# EAGLE design digital_warrior_v02 (EAGLE 6.3)
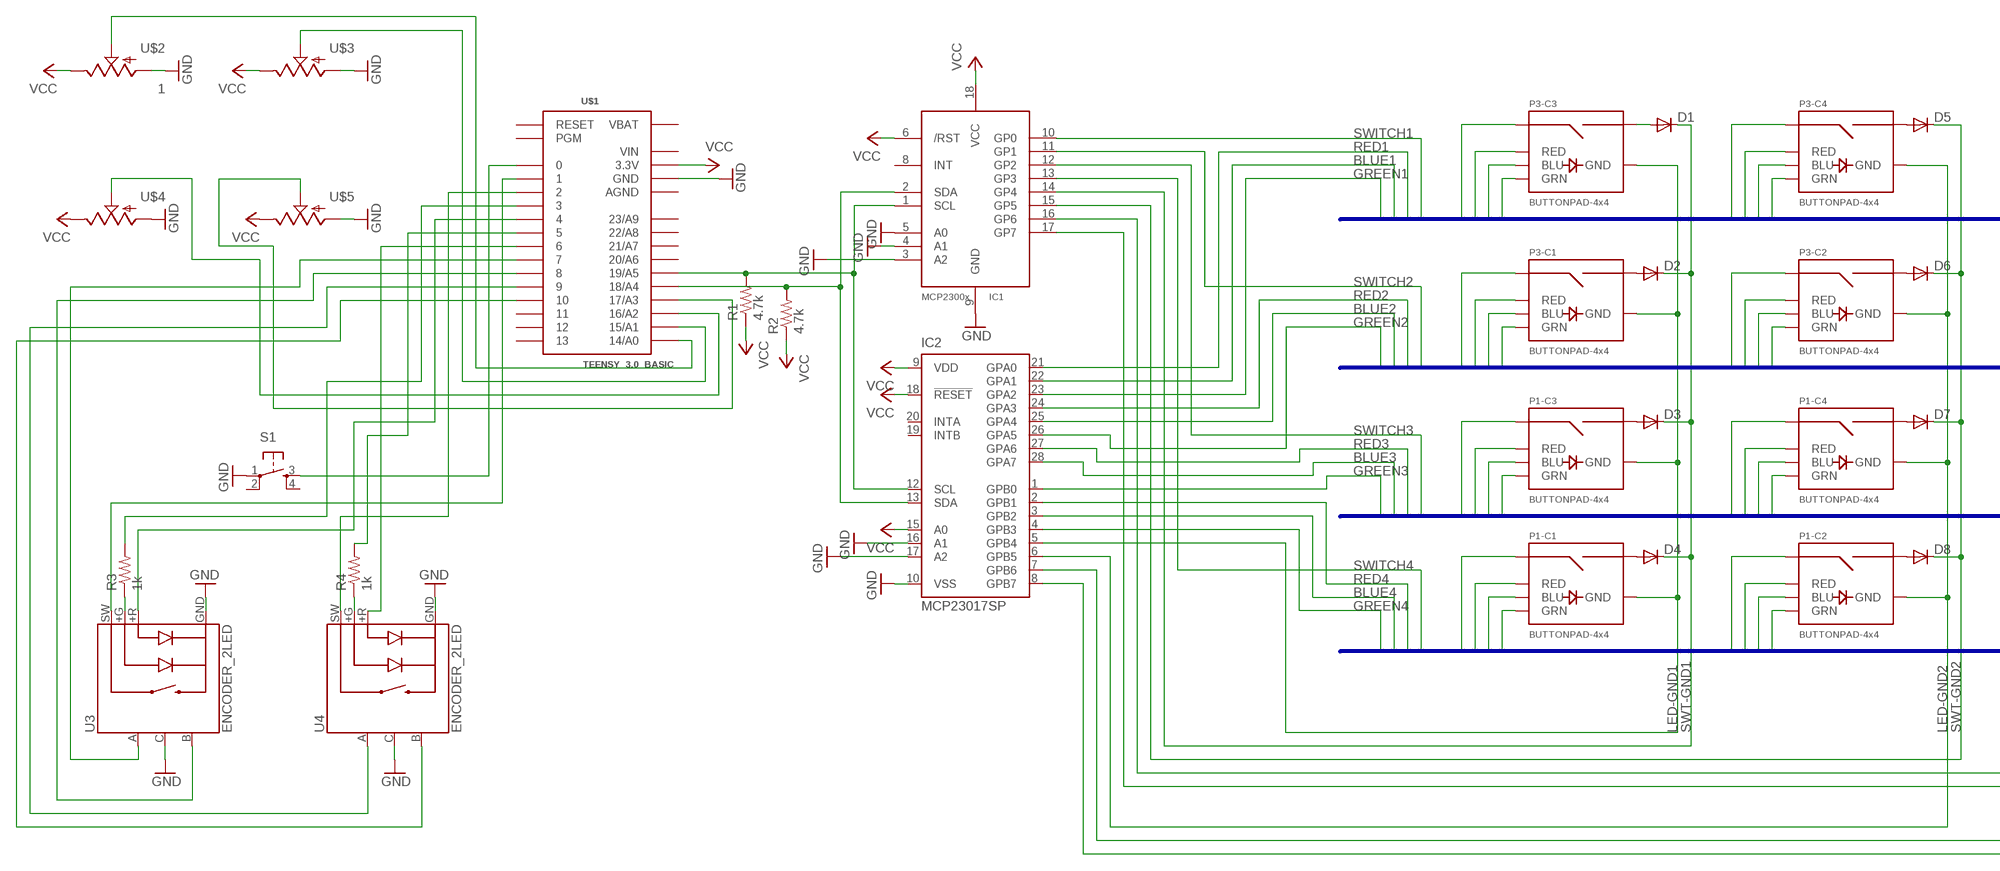
[diagram p0: schematic, sheet 1, part 1 of 2]
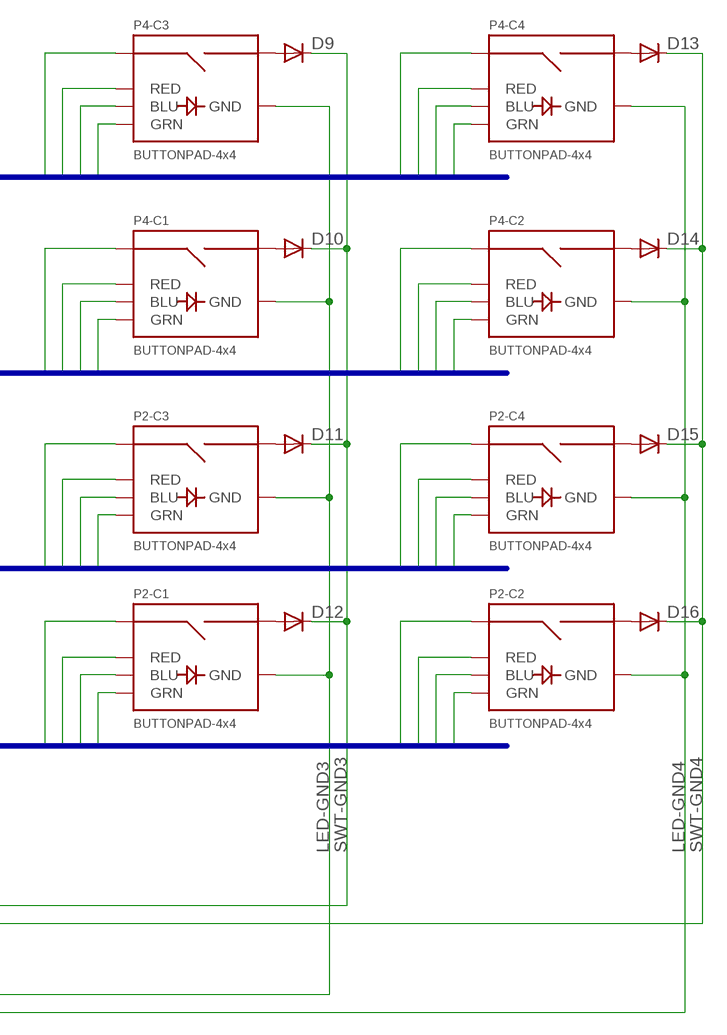
[diagram p1: schematic, sheet 1, part 2 of 2]

## Parts
D1  DIODE-1N4148  [DOIDE-1N4148]
D2  DIODE-1N4148  [DOIDE-1N4148]
D3  DIODE-1N4148  [DOIDE-1N4148]
D4  DIODE-1N4148  [DOIDE-1N4148]
D5  DIODE-1N4148  [DOIDE-1N4148]
D6  DIODE-1N4148  [DOIDE-1N4148]
D7  DIODE-1N4148  [DOIDE-1N4148]
D8  DIODE-1N4148  [DOIDE-1N4148]
D9  DIODE-1N4148  [DOIDE-1N4148]
D10  DIODE-1N4148  [DOIDE-1N4148]
D11  DIODE-1N4148  [DOIDE-1N4148]
D12  DIODE-1N4148  [DOIDE-1N4148]
D13  DIODE-1N4148  [DOIDE-1N4148]
D14  DIODE-1N4148  [DOIDE-1N4148]
D15  DIODE-1N4148  [DOIDE-1N4148]
D16  DIODE-1N4148  [DOIDE-1N4148]
IC1  MCP2300X/P  [DIL18]
IC2  MCP23017SP  [DIL28-3]
P1  BUTTONPAD-4x4  BUTTONPAD-2X2  [BUTTONPAD-2X2]
P2  BUTTONPAD-4x4  BUTTONPAD-2X2  [BUTTONPAD-2X2]
P3  BUTTONPAD-4x4  BUTTONPAD-2X2  [BUTTONPAD-2X2]
P4  BUTTONPAD-4x4  BUTTONPAD-2X2  [BUTTONPAD-2X2]
R1  4.7k  RESISTORPTH-1/4W  [AXIAL-0.4]
R2  4.7k  RESISTORPTH-1/4W  [AXIAL-0.4]
R3  1k  RESISTORPTH-1/4W  [AXIAL-0.4]
R4  1k  RESISTORPTH-1/4W  [AXIAL-0.4]
S1  TAC_SWITCHPTH  [TACTILE-PTH]
U3  ENCODER_2LED  [ENCODER_LED_2]
U4  ENCODER_2LED  [ENCODER_LED_2]
U$1  TEENSY_3.0_BASIC  [TEENSY_3.0_BASIC]
U$2  1  POT  [ALPS_POT]
U$3  POT  [ALPS_POT]
U$4  POT  [ALPS_POT]
U$5  POT  [ALPS_POT]

## Nets
BLUE1 [LEDPower]: IC2.22(GPA1) P3.BLU3(-C3:BLU) P3.BLU4(-C4:BLU) P4.BLU3(-C3:BLU) P4.BLU4(-C4:BLU)
BLUE2 [LEDPower]: IC2.25(GPA4) P3.BLU1(-C1:BLU) P3.BLU2(-C2:BLU) P4.BLU1(-C1:BLU) P4.BLU2(-C2:BLU)
BLUE3 [LEDPower]: IC2.28(GPA7) P1.BLU3(-C3:BLU) P1.BLU4(-C4:BLU) P2.BLU3(-C3:BLU) P2.BLU4(-C4:BLU)
BLUE4 [LEDPower]: IC2.3(GPB2) P1.BLU1(-C1:BLU) P1.BLU2(-C2:BLU) P2.BLU1(-C1:BLU) P2.BLU2(-C2:BLU)
GND: IC1.3(A2) IC1.4(A1) IC1.5(A0) IC1.9(GND) IC2.10(VSS) IC2.16(A1) IC2.17(A2) S1.1 U3.C U3.GND(-) U4.C U4.GND(-) U$1.GND U$1.GND1(GND) U$2.P$3(A) U$3.P$3(A) U$4.P$3(A) U$5.P$3(A)
GREEN1 [LEDPower]: IC2.23(GPA2) P3.GRN3(-C3:GRN) P3.GRN4(-C4:GRN) P4.GRN3(-C3:GRN) P4.GRN4(-C4:GRN)
GREEN2 [LEDPower]: IC2.26(GPA5) P3.GRN1(-C1:GRN) P3.GRN2(-C2:GRN) P4.GRN1(-C1:GRN) P4.GRN2(-C2:GRN)
GREEN3 [LEDPower]: IC2.1(GPB0) P1.GRN3(-C3:GRN) P1.GRN4(-C4:GRN) P2.GRN3(-C3:GRN) P2.GRN4(-C4:GRN)
GREEN4 [LEDPower]: IC2.4(GPB3) P1.GRN1(-C1:GRN) P1.GRN2(-C2:GRN) P2.GRN1(-C1:GRN) P2.GRN2(-C2:GRN)
LED-GND1 [LEDPower]: IC2.5(GPB4) P1.GND1(-C1:GND) P1.GND3(-C3:GND) P3.GND1(-C1:GND) P3.GND3(-C3:GND)
LED-GND2 [LEDPower]: IC2.6(GPB5) P1.GND2(-C2:GND) P1.GND4(-C4:GND) P3.GND2(-C2:GND) P3.GND4(-C4:GND)
LED-GND3 [LEDPower]: IC2.7(GPB6) P2.GND1(-C1:GND) P2.GND3(-C3:GND) P4.GND1(-C1:GND) P4.GND3(-C3:GND)
LED-GND4 [LEDPower]: IC2.8(GPB7) P2.GND2(-C2:GND) P2.GND4(-C4:GND) P4.GND2(-C2:GND) P4.GND4(-C4:GND)
N$1: D1.P$1(A) P3.SIG6(-C3:SIG2)
N$2: D2.P$1(A) P3.SIG2(-C1:SIG2)
N$3: D3.P$1(A) P1.SIG6(-C3:SIG2)
N$4: D4.P$1(A) P1.SIG2(-C1:SIG2)
N$5: D5.P$1(A) P3.SIG8(-C4:SIG2)
N$6: D6.P$1(A) P3.SIG4(-C2:SIG2)
N$7: D7.P$1(A) P1.SIG8(-C4:SIG2)
N$8: D8.P$1(A) P1.SIG4(-C2:SIG2)
N$9: D9.P$1(A) P4.SIG6(-C3:SIG2)
N$10: D10.P$1(A) P4.SIG2(-C1:SIG2)
N$11: D11.P$1(A) P2.SIG6(-C3:SIG2)
N$12: D12.P$1(A) P2.SIG2(-C1:SIG2)
N$13: D13.P$1(A) P4.SIG8(-C4:SIG2)
N$14: D14.P$1(A) P4.SIG4(-C2:SIG2)
N$15: D15.P$1(A) P2.SIG8(-C4:SIG2)
N$16: D16.P$1(A) P2.SIG4(-C2:SIG2)
N$17: IC1.1(SCL) IC2.12(SCL) R1.P$2 U$1.19/A5
N$18: IC1.2(SDA) IC2.13(SDA) R2.P$2 U$1.18/A4
N$19: U$1.14/A0 U$2.P$2(S)
N$20: U$1.15/A1 U$3.P$2(S)
N$21: U$1.16/A2 U$4.P$2(S)
N$22: U$1.17/A3 U$5.P$2(S)
N$23: S1.3 U$1.0
N$24: U3.SW U$1.1
N$25: U4.SW U$1.2
N$26: R3.P$2 U$1.3
N$27: U3.+R U$1.4
N$28: R3.P$1 U3.+G
N$29: R4.P$1 U4.+G
N$30: R4.P$2 U$1.5
N$31: U4.+R U$1.6
N$32: U3.A U$1.7
N$33: U3.B U$1.8
N$34: U4.A U$1.9
N$35: U4.B U$1.10
RED1 [LEDPower]: IC2.21(GPA0) P3.RED3(-C3:RED) P3.RED4(-C4:RED) P4.RED3(-C3:RED) P4.RED4(-C4:RED)
RED2 [LEDPower]: IC2.24(GPA3) P3.RED1(-C1:RED) P3.RED2(-C2:RED) P4.RED1(-C1:RED) P4.RED2(-C2:RED)
RED3 [LEDPower]: IC2.27(GPA6) P1.RED3(-C3:RED) P1.RED4(-C4:RED) P2.RED3(-C3:RED) P2.RED4(-C4:RED)
RED4 [LEDPower]: IC2.2(GPB1) P1.RED1(-C1:RED) P1.RED2(-C2:RED) P2.RED1(-C1:RED) P2.RED2(-C2:RED)
SWITCH1 [ButtonSignal]: IC1.10(GP0) P3.SIG5(-C3:SIG1) P3.SIG7(-C4:SIG1) P4.SIG5(-C3:SIG1) P4.SIG7(-C4:SIG1)
SWITCH2 [ButtonSignal]: IC1.11(GP1) P3.SIG1(-C1:SIG1) P3.SIG3(-C2:SIG1) P4.SIG1(-C1:SIG1) P4.SIG3(-C2:SIG1)
SWITCH3 [ButtonSignal]: IC1.12(GP2) P1.SIG5(-C3:SIG1) P1.SIG7(-C4:SIG1) P2.SIG5(-C3:SIG1) P2.SIG7(-C4:SIG1)
SWITCH4 [ButtonSignal]: IC1.13(GP3) P1.SIG1(-C1:SIG1) P1.SIG3(-C2:SIG1) P2.SIG1(-C1:SIG1) P2.SIG3(-C2:SIG1)
SWT-GND1 [ButtonSignal]: D1.P$2(C) D2.P$2(C) D3.P$2(C) D4.P$2(C) IC1.14(GP4)
SWT-GND2 [ButtonSignal]: D5.P$2(C) D6.P$2(C) D7.P$2(C) D8.P$2(C) IC1.15(GP5)
SWT-GND3 [ButtonSignal]: D9.P$2(C) D10.P$2(C) D11.P$2(C) D12.P$2(C) IC1.16(GP6)
SWT-GND4 [ButtonSignal]: D13.P$2(C) D14.P$2(C) D15.P$2(C) D16.P$2(C) IC1.17(GP7)
VCC: IC1.6(/RST) IC1.18(VCC) IC2.9(VDD) IC2.15(A0) IC2.18(!RESET) R1.P$1 R2.P$1 U$1.3.3V U$1.3.3V1(3.3V) U$2.P$1(E) U$3.P$1(E) U$4.P$1(E) U$5.P$1(E)
Unconnected: IC1.8(INT) IC2.19(INTB) IC2.20(INTA) S1.2 S1.4 U$1.11 U$1.12 U$1.13 U$1.20/A6 U$1.21/A7 U$1.22/A8 U$1.23/A9 U$1.PGM U$1.RESET

## Buses
BUS3:RED3,BLUE3,GREEN3,SWITCH3
BUS2:RED2,BLUE2,GREEN2,SWITCH2
BUS1:RED1,BLUE1,GREEN1,SWITCH1
BUS4:RED4,BLUE4,GREEN4,SWITCH4

## Power pins joined to a net without a drawn wire
AGND: U$1.AGND
VBAT: U$1.VBAT
VIN: U$1.VIN

## Library data of the parts
D1-D16 = SparkFun:DIODE-1N4148
IC1 = adafruit:MCP2300X: MCP23008 Inexpensive i2c i/o expander - 8 general purpose i/o pins with optional pullups
IC2 = adafruit:MCP23017: http://ww1.microchip.com/downloads/en/DeviceDoc/21952a.pdf Source: http://ww1.microchip.com/downloads/en/DeviceDoc/21952a.pdf
P1-P4 = SparkFun:BUTTONPAD-2X2: 5mm Button Pad Proven layout and schematic for 2x2 button pad. Panelize this device/fp to a 4x4 pad if needed. Spark Fun Electronics SKU : COM-07835. Compatible common cathode tri-color LED SKU : COM-00105
R1 R2 = SparkFun:RESISTOR: Resistor Basic schematic elements and footprints for 0603, 1206, and PTH resistors.
R3 R4 = SparkFun-Resistors:RESISTOR: Resistor Basic schematic elements and footprints for 0603, 1206, and PTH resistors.
S1 = SparkFun-Electromechanical:TAC_SWITCH: Momentary Switch Button commonly used for reset or general input. Spark Fun Electronics SKU : COM-00097 SMT- SWCH-08247
U3 U4 = SparkFun-Electromechanical:ENCODER_2LED: Illuminated Rotary Encoder w/ 2 LEDs
U$1 = Teensy3.0:TEENSY_3.0_BASIC: Basic Teensy 3.0 with none of the 'inner' pins enabled. See '+4', 'AllAnalogPins", and 'AllPins' packages for additional pin holes, as needed.
U$2-U$5 = SparkFun-Electromechanical:POT

## Net classes
0 Default: width 0.254 mm
1 Power: width 0.305 mm
2 LEDPower: width 0.305 mm
3 ButtonSignal: width 0.254 mm

## Board
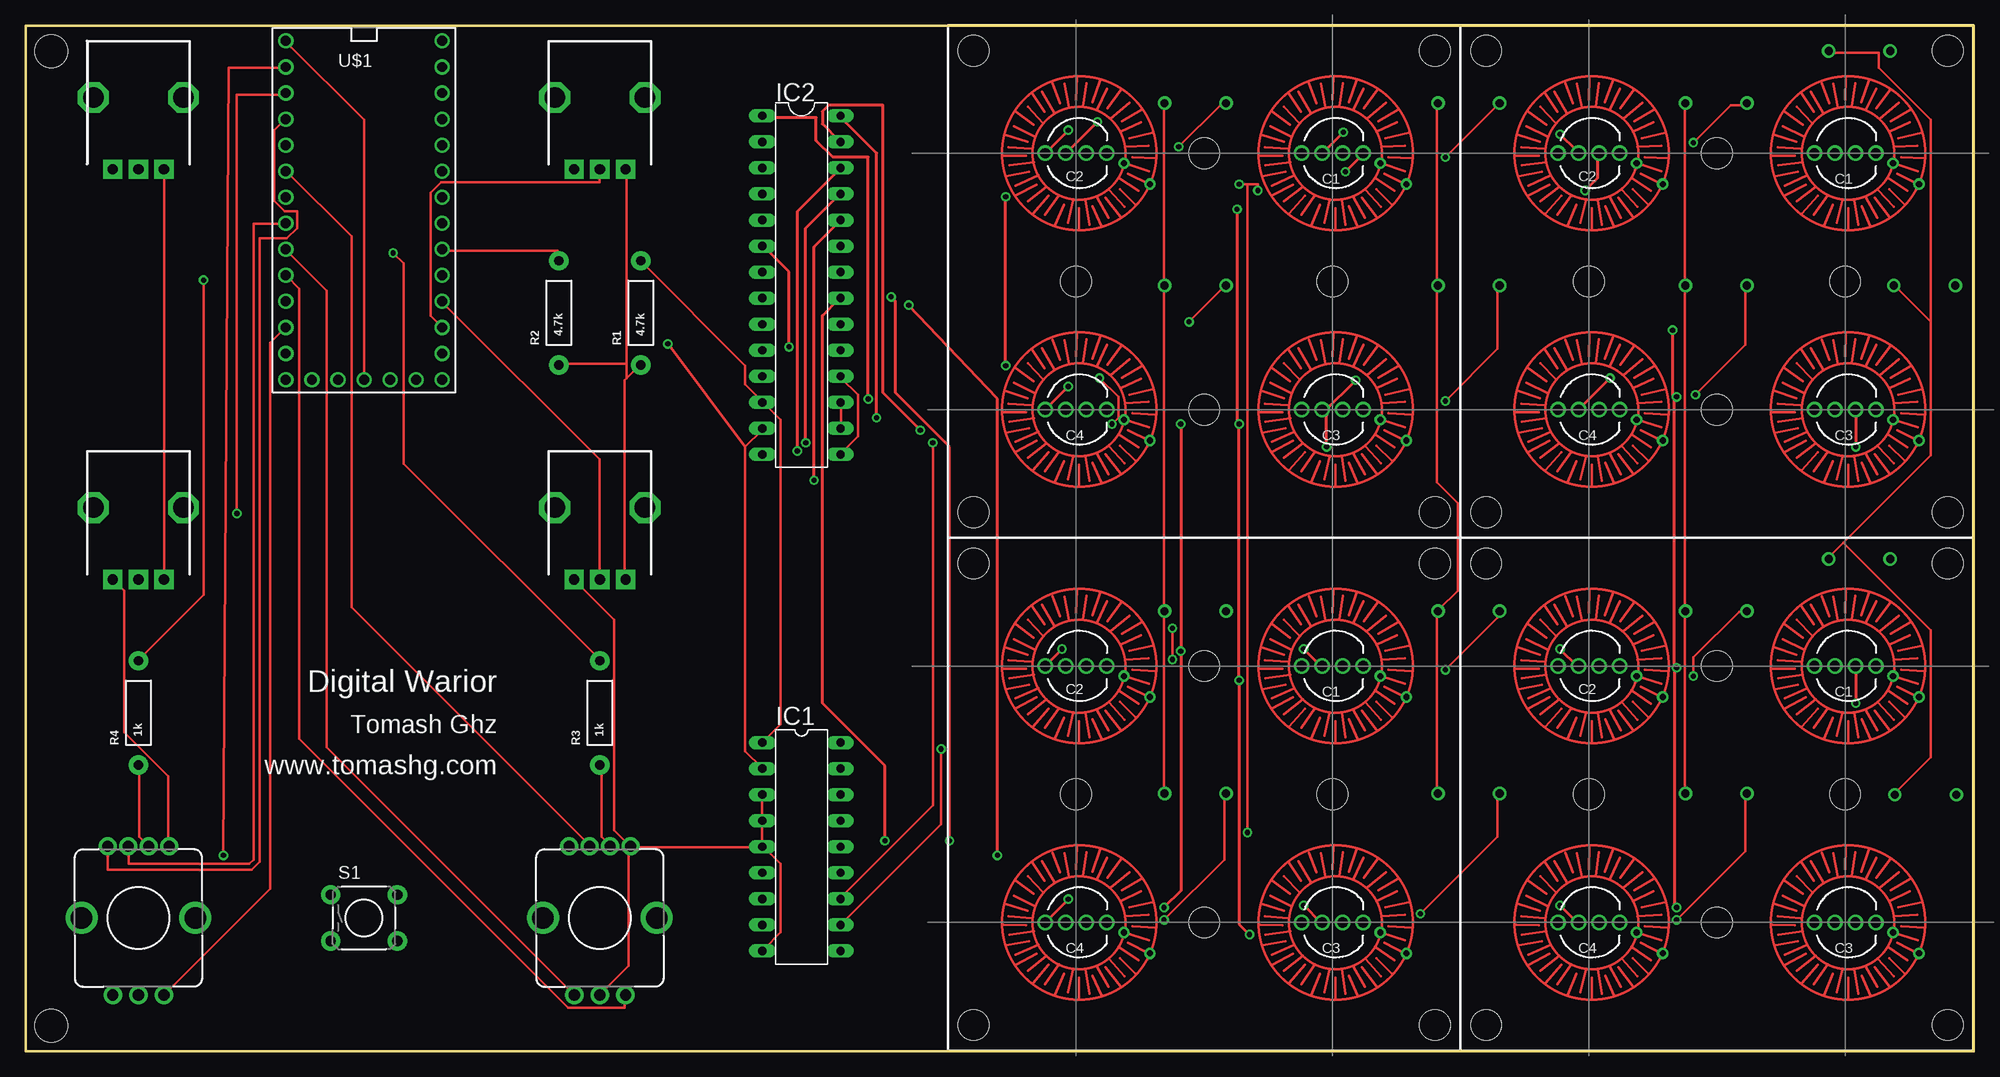
[diagram p2: board, top side]
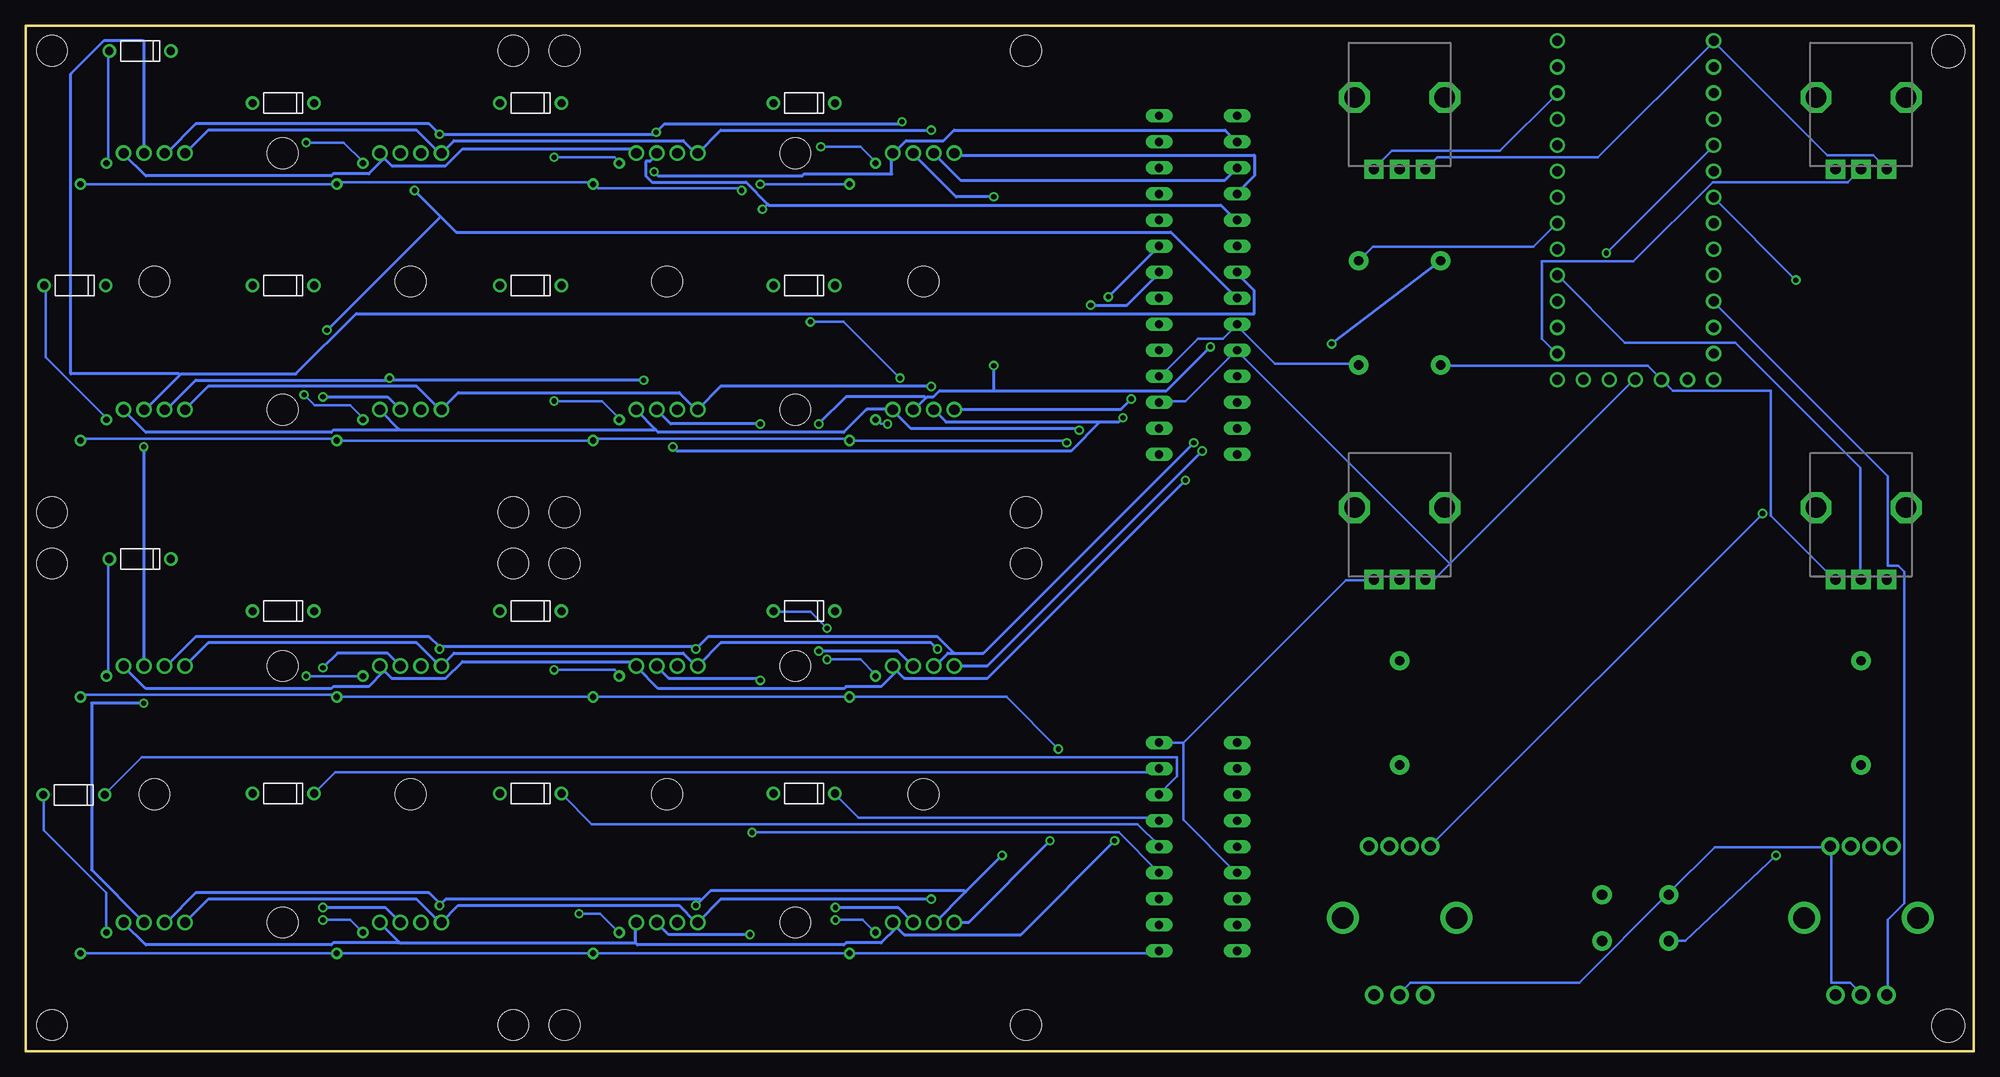
[diagram p3: board, bottom side, seen from below]

Size 190 x 100 mm. Coordinates in mm from the lower left corner, seen from the top.
Outline: 0,0 190,0 190,100 0,100 0,0
Copper layers (1*16): Top 0.035mm / dielectric 1.5mm / Bottom 0.035mm
Design rules "default": minimum track width 7mil, minimum drill 20mil, track to track 7mil, track to pad 7mil, pad to pad 7mil, via to via 7mil, smd to smd 7mil, copper to edge 20mil, drill to drill 7mil, minimum pad ring 10mil, minimum via ring 8mil, stop-mask expansion 4mil, vias tented up to drill 0mil, thermal gap 10mil
Holes 3.2 mm at 2.5,97.5 2.5,2.5

### Footprints (pad centres in the part's own frame; a part is rotated, then mirrored left to right if it is on the bottom)
DOIDE-1N4148 = drill 0.8: P$1 3,0; P$2 -3,0
DIL18 = drill 0.813 long: 1 -10.16,-3.81; 2 -7.62,-3.81; 3 -5.08,-3.81; 4 -2.54,-3.81; 5 0,-3.81; 6 2.54,-3.81; 7 5.08,-3.81; 8 7.62,-3.81; 9 10.16,-3.81; 10 10.16,3.81; 11 7.62,3.81; 12 5.08,3.81; 13 2.54,3.81; 14 0,3.81; 15 -2.54,3.81; 16 -5.08,3.81; 17 -7.62,3.81; 18 -10.16,3.81
DIL28-3 = drill 0.813 long: 1 -16.51,-3.81; 2 -13.97,-3.81; 3 -11.43,-3.81; 4 -8.89,-3.81; 5 -6.35,-3.81; 6 -3.81,-3.81; 7 -1.27,-3.81; 8 1.27,-3.81; 9 3.81,-3.81; 10 6.35,-3.81; 11 8.89,-3.81; 12 11.43,-3.81; 13 13.97,-3.81; 14 16.51,-3.81; 15 16.51,3.81; 16 13.97,3.81; 17 11.43,3.81; 18 8.89,3.81; 19 6.35,3.81; 20 3.81,3.81; 21 1.27,3.81; 22 -1.27,3.81; 23 -3.81,3.81; 24 -6.35,3.81; 25 -8.89,3.81; 26 -11.43,3.81; 27 -13.97,3.81; 28 -16.51,3.81
BUTTONPAD-2X2 = drill 1: BLU1 13.5,12.5; BLU2 38.5,12.5; BLU3 13.5,37.5; BLU4 38.5,37.5; GND1 11.5,12.5; GND2 36.5,12.5; GND3 11.5,37.5; GND4 36.5,37.5; GRN1 15.5,12.5; GRN2 40.5,12.5; GRN3 15.5,37.5; GRN4 40.5,37.5; RED1 9.5,12.5; RED2 34.5,12.5; RED3 9.5,37.5; RED4 34.5,37.5 | drill 0.6: SIG1 5.288,15.513; SIG2 7.828,13.481; SIG3 30.288,15.513; SIG4 32.828,13.481; SIG5 5.288,40.513; SIG6 7.828,38.481; SIG7 30.288,40.513; SIG8 32.828,38.481 | hole 3: 12.5,25; 25,37.5; 37.5,25; 25,12.5; 2.5,2.5; 2.5,47.5; 47.5,47.5; 47.5,2.5
AXIAL-0.4 = drill 0.9 pad 1.88: P$1 -5.08,0; P$2 5.08,0
TACTILE-PTH = drill 1.016 pad 1.88: 1 -3.251,2.261; 2 3.251,2.261; 3 -3.251,-2.261; 4 3.251,-2.261
ENCODER_LED_2 = drill 1.1 pad 1.778: +G 1,7; +R -1,7; GND 3,7; SW -3,7 | drill 1.1 pad 1.8: A -2.5,-7.5; B 2.5,-7.5; C 0,-7.5 | drill 2.1: P$1 -5.55,0; P$2 5.55,0
TEENSY_3.0_BASIC = drill 0.965: 0 -7.62,13.97; 1 -7.62,11.43; 2 -7.62,8.89; 3 -7.62,6.35; 3.3V 7.62,11.43; 3.3V1 -2.54,-16.51; 4 -7.62,3.81; 5 -7.62,1.27; 6 -7.62,-1.27; 7 -7.62,-3.81; 8 -7.62,-6.35; 9 -7.62,-8.89; 10 -7.62,-11.43; 11 -7.62,-13.97; 12 -7.62,-16.51; 13 7.62,-16.51; 14/A0 7.62,-13.97; 15/A1 7.62,-11.43; 16/A2 7.62,-8.89; 17/A3 7.62,-6.35; 18/A4 7.62,-3.81; 19/A5 7.62,-1.27; 20/A6 7.62,1.27; 21/A7 7.62,3.81; 22/A8 7.62,6.35; 23/A9 7.62,8.89; AGND 7.62,13.97; GND -7.62,16.51; GND1 0,-16.51; PGM 2.54,-16.51; RESET 5.08,-16.51; VBAT -5.08,-16.51; VIN 7.62,16.51
ALPS_POT = drill 1 pad 1.88 square: P$1 7,-2.5; P$2 7,0; P$3 7,2.5 | drill 2 octagon: P$4 0,-4.4; P$5 0,4.4

### Placement (x,y rotation side)
D1  140.74,25.13 180 bottom
D2  140.74,42.91 180 bottom
D3  140.74,74.66 180 bottom
D4  140.74,92.44 180 bottom
D5  114.07,25.13 180 bottom
D6  114.07,42.91 180 bottom
D7  114.07,74.66 180 bottom
D8  114.07,92.44 180 bottom
D9  185.29,25.01 180 bottom
D10  178.84,47.99 180 bottom
D11  185.19,74.66 180 bottom
D12  178.84,97.52 180 bottom
D13  164.87,25.13 180 bottom
D14  164.87,42.91 180 bottom
D15  164.87,74.66 180 bottom
D16  164.87,92.44 180 bottom
IC1  75.66,19.94 270 top
IC2  75.66,74.7 270 top
P1  139.94,100.06 180 top
P2  189.94,100.06 180 top
P3  139.94,50.06 180 top
P4  189.94,50.06 180 top
R1  60,72 90 top
R2  52,72 90 top
R3  56,33 90 top
R4  11,33 90 top
S1  33,13 0 top
U3  56,13 0 top
U4  11,13 0 top
U$1  33,82 0 top
U$2  11,93 270 bottom
U$3  56,93 270 bottom
U$4  56,53 270 bottom
U$5  11,53 270 bottom

### Tracks (layer width: path | path; a pad name or v marks a point on that pad's centre or on a via)
BLUE1  (via drill 0.51)
  Top 0.305: v86.13,72.75 94.77,63.6 v94.77,19.1 | v124.64,14.22 126.27,12.6 P3.BLU3 | v149.63,14.22 151.26,12.6 P4.BLU4
  Bottom 0.305: v86.13,72.75 82.58,72.75 79.53,75.79 IC2.22 | 98.33,15.54 101.27,12.6 P3.BLU4 | 98.33,15.54 v94.77,19.1 | 124.13,14.73 123.22,15.65 98.43,15.65 98.33,15.54 | 124.13,14.73 v124.64,14.22 | 124.13,14.73 124.23,14.83 149.03,14.83 v149.63,14.22 149.63,14.43 150.65,15.44 173.41,15.44 176.25,12.6 P4.BLU3
BLUE2  (via drill 0.51)
  Top 0.305: v76.08,59.33 76.08,80.26 79.33,83.52 IC2.25 | v124.64,39.22 126.27,37.59 P3.BLU1 | v149.63,39.22 151.26,37.59 P4.BLU2
  Bottom 0.305: v76.08,59.33 96.6,38.81 99.44,38.81 | 99.44,38.81 100.05,38.81 101.27,37.59 P3.BLU2 | 99.44,38.81 101.07,40.44 123.42,40.44 v124.64,39.22 124.64,39.42 149.43,39.42 v149.63,39.22 149.63,39.42 150.65,40.44 173.41,40.44 176.25,37.59 P4.BLU1
BLUE3  (via drill 0.51)
  Top 0.305: v154.51,65.63 151.46,62.59 P2.BLU4 | v82.99,61.77 82.99,87.58 79.53,91.03 IC2.28 | v126.88,58.93 126.88,61.98 126.47,62.38 P1.BLU3 126.67,62.38 v129.72,65.43
  Bottom 0.305: P2.BLU3 176.25,62.59 173.41,65.43 154.72,65.43 v154.51,65.63 154.51,65.43 v129.72,65.43 | v82.99,61.77 83.39,61.37 85.22,61.37 | 85.22,61.37 100.26,61.37 101.27,62.38 P1.BLU4 | v126.88,58.93 126.47,58.52 88.07,58.52 85.22,61.37
BLUE4  (via drill 0.51)
  Top 0.305: v128.5,89.61 126.47,87.58 P1.BLU1 | v149.63,89.41 151.26,87.78 151.26,87.58 P2.BLU2 | v104.53,90.63 101.48,87.58 P1.BLU2
  Bottom 0.305: IC2.3 72.01,85.95 73.03,84.94 98.83,84.94 101.27,87.38 P1.BLU2 | P2.BLU1 176.25,87.58 173.41,90.42 150.65,90.42 v149.63,89.41 128.71,89.41 v128.5,89.61 127.69,90.42 104.73,90.42 v104.53,90.63
GND
  Top 0.254: U$5.P$3 8.61,45.92 9.63,44.91 9.63,31.09 13.9,26.82 13.9,20.12 U4.GND | 25.48,98.55 U$1.GND 25.48,98.35 33,90.83 33,65.63 U$1.GND1 | 71.81,9.75 IC1.9 72.01,9.96 73.64,11.58 73.64,18.29 72.01,19.91 IC1.5 | IC1.5 71.81,20.12 71.81,22.35 IC1.4 71.81,22.55 71.81,24.99 IC1.3 | U3.GND 59.01,19.91 71.81,19.91 IC1.5 | U3.C 56.16,5.69 58.8,8.33 58.8,19.91 U3.GND | IC2.16 79.53,60.76 79.53,63.2 IC2.17 | U3.GND 58.8,20.12 57.38,21.54 57.38,42.06 53.52,45.92 U$4.P$3
  Bottom 0.254: U4.C 11.05,5.69 12.07,6.71 13.9,6.71 13.9,19.91 U4.GND 14.1,19.91 25.28,19.91 29.75,15.44 S1.1 29.95,15.24 38.48,6.71 54.94,6.71 55.96,5.69 U3.C | U$2.P$3 8.61,86.16 9.83,87.38 14.3,87.38 25.28,98.35 U$1.GND 25.48,98.35 36.66,87.17 52.3,87.17 53.32,86.16 U$3.P$3 | IC2.17 79.33,63.4 76.89,63.4 72.01,68.28 IC2.10 71.81,68.28 51.08,47.55 | 51.08,47.55 52.51,46.13 53.32,46.13 U$4.P$3 | 51.08,47.55 33.2,65.43 U$1.GND1
GREEN1  (via drill 0.51)
  Top 0.305: v84.41,73.56 84.81,73.15 84.81,64.21 90.1,58.93 v90.1,20.52 | v101.68,14.83 99.44,12.6 P3.GRN4
  Bottom 0.305: P4.GRN3 174.43,12.6 172.19,14.83 151.87,14.83 149.63,12.6 P4.GRN4 149.43,12.6 147.81,14.22 126.27,14.22 124.64,12.6 P3.GRN3 124.44,12.6 122.2,14.83 v101.68,14.83 | v84.41,73.56 79.53,78.44 IC2.23 | v90.1,20.52 98.02,12.6 99.24,12.6 P3.GRN4
GREEN2  (via drill 0.51)
  Top 0.305: v75.26,58.52 75.26,81.89 79.33,85.95 IC2.26 | v101.07,39.22 99.44,37.59 P3.GRN2
  Bottom 0.305: P4.GRN1 174.43,37.59 172.19,39.83 151.87,39.83 149.63,37.59 P4.GRN2 149.43,37.59 148.21,38.81 125.86,38.81 124.64,37.59 P3.GRN1 124.44,37.59 122.2,39.83 101.68,39.83 v101.07,39.22 | v75.26,58.52 96.19,37.59 99.24,37.59 P3.GRN2
GREEN3  (via drill 0.51)
  Top 0.305: v82.17,63.6 82.17,87.17 78.72,87.17 77.09,88.8 77.09,91.03 72.01,91.03 IC2.1 | v101.68,64.82 99.44,62.59 P1.GRN4
  Bottom 0.305: P2.GRN3 174.43,62.59 172.19,64.82 151.87,64.82 149.63,62.59 P2.GRN4 149.43,62.59 147.81,64.21 126.27,64.21 124.64,62.59 P1.GRN3 124.44,62.59 122.2,64.82 v101.68,64.82 | v82.17,63.6 83.19,62.59 99.24,62.59 P1.GRN4
GREEN4  (via drill 0.51)
  Top 0.305: v101.68,89.81 99.44,87.58 P1.GRN2
  Bottom 0.305: IC2.4 71.81,83.72 70.18,85.34 70.18,87.38 99.24,87.38 P1.GRN2 | P2.GRN1 174.43,87.58 172.19,89.81 151.87,89.81 149.63,87.58 P2.GRN2 149.43,87.58 148.21,88.8 125.86,88.8 124.64,87.58 P1.GRN1 124.44,87.58 122.2,89.81 v101.68,89.81
LED-GND1  (via drill 0.51)
  Top 0.305: v119.36,11.38 118.34,12.39 v118.34,36.17 v118.34,61.16 118.14,61.37 v118.14,82.09
  Bottom 0.305: v119.36,11.38 127.28,11.38 128.3,12.39 P3.GND3 | v118.34,36.17 118.55,36.37 127.28,36.37 128.3,37.39 P3.GND1 | v118.34,61.16 127.08,61.16 128.3,62.38 P1.GND3 | 117.63,82.6 119.77,84.73 128.91,84.73 129.52,85.34 129.52,86.77 129.11,86.77 128.5,87.38 P1.GND1 | 117.63,82.6 117.53,82.5 73.44,82.5 72.01,81.08 IC2.5 | 117.63,82.6 v118.14,82.09
LED-GND2  (via drill 0.51)
  Top 0.305: v111.03,14.02 112.65,15.65 v112.65,39.01 v112.65,61.16 | v74.45,68.68 74.45,76 72.01,78.44 IC2.6 | v95.58,66.85 v95.58,83.31
  Bottom 0.305: v111.03,14.02 104.93,14.02 103.51,12.6 P3.GND4 | v112.65,39.01 104.93,39.01 103.51,37.59 P3.GND2 | v74.45,68.68 78.72,64.41 95.58,64.41 | 95.58,64.41 100.87,64.41 101.48,63.8 102.09,63.8 102.19,63.7 | 102.19,63.7 103.31,62.59 P1.GND4 | v95.58,83.31 99.24,83.31 103.31,87.38 P1.GND2 | 95.58,64.41 v95.58,66.85 | v112.65,61.16 110.01,63.8 102.29,63.8 102.19,63.7
LED-GND3  (via drill 0.51)
  Top 0.305: v178.49,33.93 178.49,37.39 P4.GND1 | v178.49,58.93 178.49,62.38 P2.GND3
  Bottom 0.305: v178.49,33.93 183.57,33.93 183.57,17.68 178.49,12.6 P4.GND3 | 174.93,65.94 178.29,62.59 P2.GND3 | 174.93,65.94 174.83,66.04 163.66,66.04 157.76,71.93 70.18,71.93 70.18,74.17 71.81,75.79 IC2.7 | P2.GND1 178.49,87.58 178.49,98.55 182.35,98.55 185.6,95.3 185.6,66.04 175.03,66.04 174.93,65.94 | v178.49,58.93 178.49,37.59 P4.GND1
LED-GND4  (via drill 0.51)
  Top 0.305: v161.01,14.02 160.81,14.22 160.81,37.19 v161.01,37.39 160.81,37.39 160.81,63.6 v161.01,63.8 160.81,63.8 160.61,64.01 v160.61,70.31 | v152.07,83.92 153.29,85.14 153.29,87.38 P2.GND2
  Bottom 0.305: v161.01,14.02 154.92,14.02 153.5,12.6 P4.GND4 | v161.01,37.39 159.59,38.81 154.72,38.81 153.5,37.59 P4.GND2 | v161.01,63.8 154.72,63.8 153.5,62.59 P2.GND4 | v152.07,83.92 149.53,81.38 | 149.53,81.38 148.01,79.86 78.31,79.86 72.01,73.56 IC2.8 | 149.53,81.38 v160.61,70.31
N$1  (via drill 0.51)
  Top 0.254: v136.02,13.41 143.54,20.93 143.54,24.99 D1.P$1
  Bottom 0.254: v136.02,13.41 133.99,13.41 132.16,11.58 P3.SIG6
N$2  (via drill 0.51)
  Top 0.254: v138.46,37.19 143.54,42.27 143.54,42.88 D2.P$1
  Bottom 0.254: v138.46,37.19 132.57,37.19 132.16,36.78 P3.SIG2
N$3  (via drill 0.51)
  Top 0.254: v138.46,63.4 143.54,68.48 143.54,74.57 D3.P$1
  Bottom 0.254: v138.46,63.4 133.79,63.4 132.16,61.77 P1.SIG6
N$4  (via drill 0.51)
  Top 0.254: v138.46,87.17 143.54,92.25 D4.P$1
  Bottom 0.254: v138.46,87.17 132.57,87.17 132.16,86.77 P1.SIG2
N$5  (via drill 0.51)
  Top 0.254: v111.03,12.8 116.92,18.69 116.92,24.99 D5.P$1
  Bottom 0.254: v111.03,12.8 108.39,12.8 107.17,11.58 P3.SIG8
N$6  (via drill 0.51)
  Top 0.254: v111.84,41.25 v111.84,38.2
  Bottom 0.254: v111.84,38.2 108.59,38.2 107.17,36.78 P3.SIG4 | v111.84,41.25 113.47,42.88 116.92,42.88 D6.P$1
N$7  (via drill 0.51)
  Top 0.254: v105.95,61.16 106.56,61.77 106.56,63.8 v104.73,65.63 | v113.47,71.12 116.92,74.57 D7.P$1
  Bottom 0.254: v105.95,61.16 106.56,61.16 106.96,61.57 P1.SIG8 | v104.73,65.63 110.21,71.12 v113.47,71.12
N$8  (via drill 0.51)
  Top 0.254: v112.45,88.19 116.51,92.25 116.92,92.25 D8.P$1
  Bottom 0.254: v112.45,88.19 108.59,88.19 107.17,86.77 P1.SIG4
N$9
  Bottom 0.254: P4.SIG6 182.15,11.58 182.15,15.44 188.24,21.54 188.24,24.99 D9.P$1
N$10
  Bottom 0.254: P4.SIG2 181.94,36.78 181.94,47.95 D10.P$1
N$11
  Bottom 0.254: P2.SIG6 182.15,61.77 188.04,67.67 188.04,74.57 D11.P$1
N$12
  Bottom 0.254: P2.SIG2 181.94,86.77 181.94,97.33 D12.P$1
N$13  (via drill 0.51)
  Top 0.254: v161.01,12.8 167.72,19.51 167.72,24.99 D13.P$1
  Bottom 0.254: v161.01,12.8 158.37,12.8 157.15,11.58 P4.SIG8
N$14  (via drill 0.51)
  Top 0.254: v162.64,36.58 162.64,38.41 167.11,42.88 167.72,42.88 D14.P$1
  Bottom 0.254: v162.64,36.58 157.15,36.58 P4.SIG4
N$15  (via drill 0.51)
  Top 0.254: v162.84,64.01 167.72,68.89 167.72,74.57 D15.P$1
  Bottom 0.254: v162.84,64.01 161.83,62.99 158.37,62.99 157.15,61.77 P2.SIG8
N$16  (via drill 0.51)
  Top 0.254: v162.64,88.59 166.3,92.25 167.72,92.25 D16.P$1
  Bottom 0.254: v162.64,88.59 158.98,88.59 157.15,86.77 P2.SIG4
N$17
  Top 0.254: IC1.1 72.01,30.28 73.64,31.9 73.64,61.57 72.01,63.2 IC2.12 71.81,63.4 70.18,65.02 70.18,66.85 60.02,77.01 R1.P$2
  Bottom 0.254: U$1.19/A5 40.72,80.67 42.95,78.44 58.6,78.44 59.82,77.22 R1.P$2
N$18  (via drill 0.51)
  Top 0.254: U$1.18/A4 40.72,78.03 51.9,78.03 51.9,77.22 R2.P$2 | 70.18,58.93 70.18,29.26 71.81,27.64 IC1.2 | 70.18,58.93 71.81,60.55 IC2.13 | 70.18,58.93 v62.63,68.98
  Bottom 0.254: v62.63,68.98 52.1,77.01 R2.P$2
N$19
  Bottom 0.254: U$1.14/A0 40.72,68.07 42.14,69.49 42.14,77.01 33.2,77.01 25.48,84.73 12.27,84.73 11.05,85.95 U$2.P$2
N$20
  Top 0.254: U$1.15/A1 40.52,70.71 39.5,71.73 39.5,83.72 40.52,84.73 55.96,84.73 55.96,85.95 U$3.P$2
N$21
  Top 0.254: U$1.16/A2 40.72,72.95 55.96,57.71 55.96,46.13 U$4.P$2
N$22
  Bottom 0.254: U$1.17/A3 40.52,75.59 34.01,69.09 23.25,69.09 11.05,56.9 11.05,46.13 U$5.P$2
N$23  (via drill 0.51)
  Top 0.254: v19.29,19.1 19.79,95.91 25.28,95.91 U$1.0
  Bottom 0.254: v19.29,19.1 28.12,10.77 29.75,10.77 S1.3
N$24  (via drill 0.51)
  Top 0.254: v20.6,52.43 20.6,93.27 25.28,93.27 U$1.1
  Bottom 0.254: v20.6,52.43 52.91,20.12 U3.SW
N$25
  Top 0.254: U$1.2 25.28,90.83 24.26,89.81 24.26,82.91 25.28,81.89 26.5,81.89 26.5,80.26 25.48,79.25 22.84,79.25 22.84,18.49 22.03,17.68 8.01,17.68 8.01,19.91 U4.SW
N$26  (via drill 0.51)
  Top 0.254: v35.84,77.83 36.86,76.81 36.86,57.3 55.96,38.2 R3.P$2
  Bottom 0.254: v35.84,77.83 25.48,88.19 U$1.3
N$27
  Top 0.254: U$1.4 25.48,85.75 31.78,79.45 31.78,43.28 54.94,20.12 U3.+R
N$28
  Top 0.254: U3.+G 56.98,20.12 56.16,20.93 56.16,27.84 R3.P$1
N$29
  Top 0.254: U4.+G 11.87,20.12 11.05,20.93 11.05,27.84 R4.P$1
N$30  (via drill 0.51)
  Top 0.254: v17.35,75.18 17.35,44.5 11.05,38.2 R4.P$2
  Bottom 0.254: v17.35,75.18 25.28,83.11 U$1.5
N$31
  Top 0.254: U$1.6 25.28,80.67 22.23,80.67 22.23,18.69 21.82,18.29 10.04,18.29 10.04,19.91 U4.+R
N$32
  Top 0.254: U$1.7 25.48,78.03 29.34,74.17 29.34,29.67 53.32,5.69 U3.A
N$33
  Top 0.254: U$1.8 25.48,75.59 26.7,74.37 26.7,30.48 52.91,4.27 58.4,4.27 58.4,5.49 U3.B
N$34
  Bottom 0.254: U$1.9 25.28,72.95 8.41,56.08 8.41,47.35 7.39,47.35 6.79,46.74 6.79,14.43 8.41,12.8 8.41,5.69 U4.A
N$35
  Top 0.254: U$1.10 25.28,70.51 23.85,69.09 23.85,15.85 13.69,5.69 U4.B
RED1  (via drill 0.51)
  Top 0.305: v83.8,20.52 83.8,27.84 77.7,33.93 77.7,71.73 79.33,73.36 IC2.21
  Bottom 0.305: 130.53,10.57 130.53,12.39 P3.RED3 | 130.53,10.57 153.5,10.57 153.6,10.67 | 153.6,10.67 155.32,12.39 P4.RED4 | P4.RED3 180.32,12.39 178.29,10.36 160.2,10.36 160,10.57 153.7,10.57 153.6,10.67 | v83.8,20.52 92.94,11.38 104.32,11.38 105.34,12.39 P3.RED4 105.13,11.99 106.56,10.57 110.01,10.57 110.21,10.36 130.33,10.36 130.53,10.57
RED2  (via drill 0.51)
  Top 0.305: v76.89,55.68 76.89,78.44 79.33,80.87 IC2.24
  Bottom 0.305: P4.RED1 180.32,37.39 178.29,35.36 160.2,35.36 160,35.56 156.54,35.56 155.12,36.98 P4.RED2 155.32,37.39 154.31,36.37 149.03,36.37 147.4,38 130.94,38 130.53,37.59 P3.RED1 130.33,37.39 128.3,35.36 110.21,35.36 110.01,35.56 106.56,35.56 105.13,36.98 P3.RED2 105.34,37.39 104.32,36.37 96.19,36.37 v76.89,55.68
RED3  (via drill 0.51)
  Top 0.305: v87.25,60.55 83.59,64.21 83.59,92.25 78.31,92.25 77.7,91.64 77.7,90.42 79.33,88.8 IC2.27
  Bottom 0.305: v87.25,60.55 87.46,60.76 103.71,60.76 105.34,62.38 P1.RED4 105.54,62.59 107.98,62.59 110.21,60.35 128.3,60.35 128.6,60.66 | 128.6,60.66 130.33,62.38 P1.RED3 | 153.6,60.66 153.5,60.55 128.71,60.55 128.6,60.66 | 153.6,60.66 155.32,62.38 P2.RED4 | P2.RED3 180.32,62.38 178.29,60.35 160.2,60.35 160,60.55 153.7,60.55 153.6,60.66
RED4  (via drill 0.51)
  Top 0.305: v128.71,85.75 130.33,87.38 P1.RED1
  Bottom 0.305: IC2.2 72.01,88.8 73.03,89.81 99.44,89.81 100.46,88.8 104.12,88.8 105.34,87.58 P1.RED2 105.54,87.38 105.54,85.55 114.08,85.55 114.28,85.34 128.3,85.34 v128.71,85.75 | P1.RED1 130.53,87.58 130.94,87.99 147.4,87.99 149.03,86.36 154.31,86.36 155.32,87.38 P2.RED2 155.12,86.97 156.54,85.55 160,85.55 160.2,85.34 178.29,85.34 180.32,87.38 P2.RED1
SWITCH1
  Bottom 0.254: P4.SIG5 184.59,9.55 159.79,9.55 P4.SIG7 159.59,9.55 134.8,9.55 P3.SIG5 134.6,9.55 109.81,9.55 P3.SIG7 109.61,9.55 79.73,9.55 79.53,9.75 IC1.10
SWITCH2  (via drill 0.51)
  Top 0.254: v89.28,29.46 89.28,22.15 79.53,12.39 IC1.11
  Bottom 0.254: P4.SIG1 184.59,34.75 159.79,34.75 P4.SIG3 159.59,34.54 134.8,34.54 P3.SIG1 134.6,34.54 109.81,34.54 P3.SIG3 109.61,34.54 94.36,34.54 v89.28,29.46
SWITCH3  (via drill 0.51)
  Top 0.254: v88.47,59.33 88.47,23.98 79.53,15.04 IC1.12
  Bottom 0.254: P2.SIG5 184.59,59.74 159.79,59.74 P2.SIG7 159.59,59.54 134.8,59.54 P1.SIG5 134.6,59.74 109.81,59.74 P1.SIG7 109.61,59.54 88.67,59.54 v88.47,59.33
SWITCH4  (via drill 0.51)
  Top 0.254: 119.16,84.53 120.17,84.53 v120.17,83.92 | 119.16,84.53 v118.34,84.53 | 119.16,84.53 v119.16,21.34
  Bottom 0.254: P2.SIG1 184.59,84.53 159.79,84.53 P2.SIG3 159.59,84.73 134.8,84.73 P1.SIG1 134.6,84.53 134.19,84.12 120.37,84.12 v120.17,83.92 | v118.34,84.53 109.81,84.53 P1.SIG3 | v119.16,21.34 83.39,21.34 79.53,17.48 IC1.13
SWT-GND1
  Top 0.254: D4.P$2 137.65,92.25 137.65,74.78 D3.P$2 137.65,74.57 137.65,55.47 139.68,53.44 139.68,44.91 137.85,43.08 D2.P$2 137.65,42.88 137.65,25.2 D1.P$2
  Bottom 0.254: IC1.14 79.53,20.12 81.56,22.15 134.8,22.15 137.65,24.99 D1.P$2
SWT-GND2
  Top 0.254: D8.P$2 111.03,92.25 111.03,74.78 D7.P$2 111.03,74.57 111.03,43.08 D6.P$2 111.03,42.88 111.03,25.2 D5.P$2
  Bottom 0.254: IC1.15 79.53,22.55 79.73,22.76 108.79,22.76 111.03,24.99 D5.P$2
SWT-GND3
  Top 0.254: 177.27,49.58 185.81,58.12 185.81,71.12 | 177.27,49.58 175.85,48.16 D10.P$2 | 185.81,71.12 182.35,74.57 D11.P$2 | 185.81,71.12 185.81,90.83 180.72,95.91 180.72,97.33 175.85,97.33 D12.P$2 | 177.27,49.58 185.81,41.05 185.81,28.65 182.35,25.2 D9.P$2
  Bottom 0.254: IC1.16 79.33,25.2 77.7,26.82 77.7,28.65 178.69,28.65 182.15,25.2 D9.P$2
SWT-GND4
  Top 0.254: D16.P$2 161.83,92.25 161.83,74.78 D15.P$2 161.83,74.57 161.83,43.08 D14.P$2 161.83,42.88 161.83,25.2 D13.P$2
  Bottom 0.254: IC1.17 79.53,27.43 79.73,27.23 159.79,27.23 161.83,25.2 D13.P$2
VCC
  Top 0.254: U$2.P$1 13.49,85.95 13.49,46.13 U$5.P$1 | IC2.15 79.53,58.32 81.16,59.94 81.16,64.01 79.53,65.63 IC2.18 | 79.53,30.07 IC1.18 | 58.6,65.63 59.82,66.85 R1.P$1 | 58.6,65.63 58.4,65.43 58.4,46.13 U$4.P$1 | 58.6,65.63 58.6,67.06 | 58.6,67.06 58.6,85.95 U$3.P$1 | 58.6,67.06 52.1,67.06 R2.P$1
  Bottom 0.254: R2.P$1 51.9,66.85 31.78,66.85 30.56,65.63 U$1.3.3V1 30.36,65.43 29.34,64.41 19.79,64.41 19.79,52.22 13.69,46.13 U$5.P$1 | U$1.3.3V 40.72,93.27 46.21,87.78 56.77,87.78 58.4,86.16 U$3.P$1 | IC2.18 79.33,65.84 75.67,69.49 73.23,69.49 72.01,70.71 IC2.9 71.81,70.71 68.15,67.06 60.02,67.06 R1.P$1 | 77.09,30.07 77.09,22.55 72.01,17.48 IC1.6 | 77.09,30.07 79.33,30.07 IC1.18 | 77.09,30.07 61.24,45.92 58.6,45.92 U$4.P$1

### Text on the board
tPlace: Digital Warior | Tomash Ghz | www.tomashg.com